# Altium schematic sheet VGA.SchDoc (part 2 of 3)
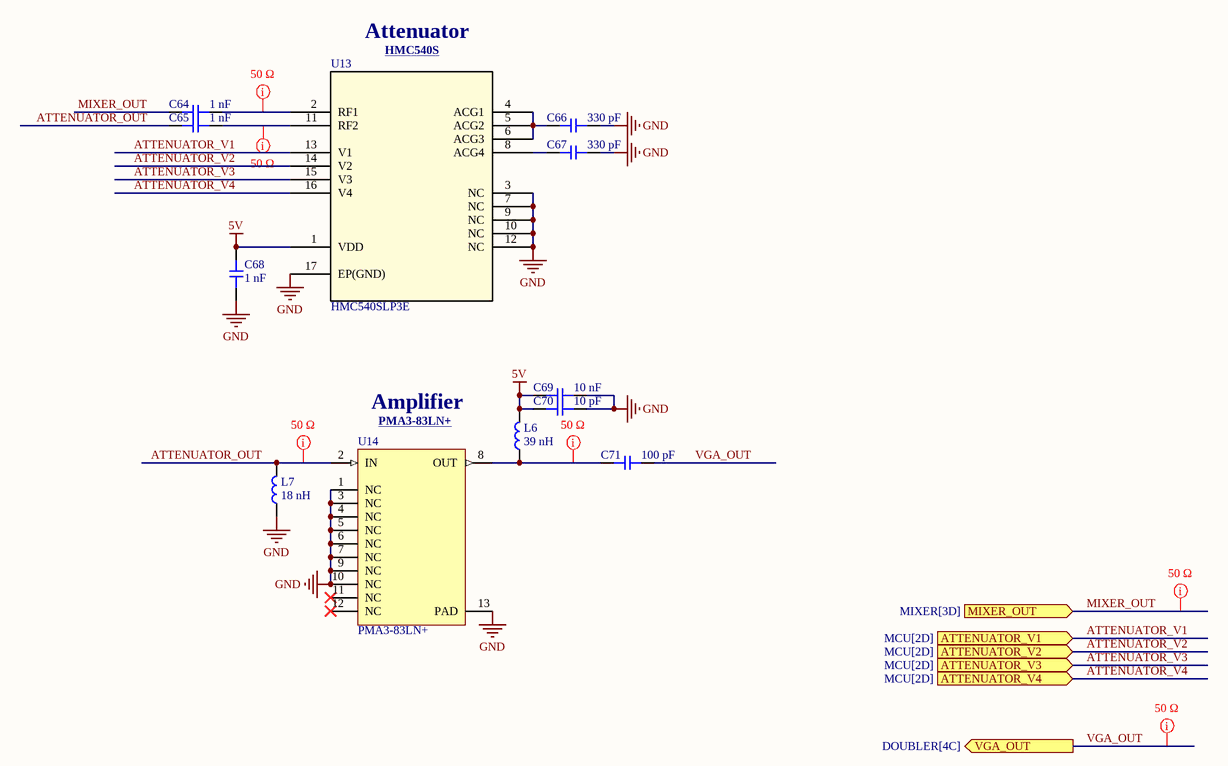
[diagram p1: VGA.SchDoc]
## Library data of the parts
C64 C65 C68 = CAP: 50V 1nF X7R ±10% 0402 Multilayer Ceramic Capacitors MLCC - SMD/SMT ROHS; Manufacturer: Yageo; Manufacturer Part Number: CC0402KRX7R9BB102; Tolerance: +-10%; Insulation Resistance: 100GΩ; Temperature Coefficient: 30ppm/°C; Voltage Rating: 50 V; Dielectric: Ceramic; Package Size: 0402; Supplier: DigiKey; Supplier Part Number: 311-1036-1-ND; RoHS: Compliant; Category: Ceramic Capacitors; Stock: 3090255; Pricing: 1=0.08, 10=0.004 (USD); Value: 1nF; Case/Package: 0402; Case Code (Imperial): 0402; Case Code (Metric): 1005; China RoHS: Compliant; Composition: Ceramic; Country of Origin: Mainland China, Taiwan; Depth: 500µm; Dielectric Material: Ceramic; Export Control Classification Number (ECCN) Code: EAR99; Halogen Free: Halogen Free; Height: 500µm; Harmonized Tariff Schedule (HTS) Code: 8532.24.00.20; Introduction Date: 2003-01-27; Lead Free: Lead Free; Length: 1mm; Lifecycle Status: Production; Material: Ceramic; Max Operating Temperature: 125°C; Min Operating Temperature: -55°C; Mounting Technology: Surface Mount; Pins: 2; Number of Terminals: 2; Radiation Hardening: No; REACH SVHC: Yes; Schedule B: 8532240020, 8532240020|8532240020|8532240020|8532240020|8532240020|8532240020|8532240020|8532240020|8532240020|8532240020|8532240020|8532240020|8532240020|8532240020|8532240020|8532240020|8532240020|8532240020|8532240020|8532240020|8532240020|8532240020|8532240020|85; Termination: SMD/SMT; Thickness: 558.8µm; Voltage: 50V; Voltage Rating (AC): 50V; Voltage Rating (DC): 50V; Width: 500µm; ComponentLink1URL: https://datasheet.octopart.com:443/CC0402KRX7R9BB102-Yageo-datasheet-177165144.pdf?src-supplier=IHS; ComponentLink1Description: https://datasheet.octopart.com:443/CC0402KRX7R9BB102-Yageo-datasheet-177165144.pdf?src-supplier=IHS; ComponentLink2URL: https://datasheet.octopart.com:443/CC0402KRX7R9BB102-Yageo-datasheet-82288757.pdf?src-supplier=Upverter; ComponentLink2Description: https://datasheet.octopart.com:443/CC0402KRX7R9BB102-Yageo-datasheet-82288757.pdf?src-supplier=Upverter; ComponentLink3URL: https://datasheet.octopart.com:443/CC0402KRX7R9BB102-Yageo-datasheet-78855684.pdf?src-supplier=Upverter; ComponentLink3Description: https://datasheet.octopart.com:443/CC0402KRX7R9BB102-Yageo-datasheet-78855684.pdf?src-supplier=Upverter; ComponentLink4URL: https://datasheet.octopart.com/CC0402KRX7R9BB102-Yageo-datasheet-10883670.pdf; ComponentLink4Description: https://datasheet.octopart.com/CC0402KRX7R9BB102-Yageo-datasheet-10883670.pdf; ComponentLink5URL: https://datasheet.octopart.com:443/CC0402KRX7R9BB102-Yageo-datasheet-147453679.pdf?src-supplier=Farnell; ComponentLink5Description: https://datasheet.octopart.com:443/CC0402KRX7R9BB102-Yageo-datasheet-147453679.pdf?src-supplier=Farnell; ComponentLink6URL: https://datasheet.octopart.com:443/CC0402KRX7R9BB102-Yageo-datasheet-151948686.pdf?src-supplier=Farnell; ComponentLink6Description: https://datasheet.octopart.com:443/CC0402KRX7R9BB102-Yageo-datasheet-151948686.pdf?src-supplier=Farnell; ComponentLink7URL: https://datasheet.octopart.com:443/CC0402KRX7R9BB102-Phycomp-datasheet-500777.pdf?src-supplier=Farnell; ComponentLink7Description: https://datasheet.octopart.com:443/CC0402KRX7R9BB102-Phycomp-datasheet-500777.pdf?src-supplier=Farnell; ComponentLink8URL: https://datasheet.octopart.com:443/CC0402KRX7R9BB102-Yageo-datasheet-5301394.pdf?src-supplier=Newark; ComponentLink8Description: https://datasheet.octopart.com:443/CC0402KRX7R9BB102-Yageo-datasheet-5301394.pdf?src-supplier=Newark; ComponentLink9URL: https://datasheet.octopart.com:443/CC0402KRX7R9BB102-Yageo-datasheet-62336348.pdf?src-supplier=Newark; ComponentLink9Description: https://datasheet.octopart.com:443/CC0402KRX7R9BB102-Yageo-datasheet-62336348.pdf?src-supplier=Newark; ComponentLink10URL: https://datasheet.octopart.com:443/CC0402KRX7R9BB102-Yageo-datasheet-182878162.pdf?src-supplier=Newark; ComponentLink10Description: https://datasheet.octopart.com:443/CC0402KRX7R9BB102-Yageo-datasheet-182878162.pdf?src-supplier=Newark; ComponentLink11URL: https://datasheet.octopart.com:443/CC0402KRX7R9BB102-Phycomp-datasheet-499490.pdf?src-supplier=element14; ComponentLink11Description: https://datasheet.octopart.com:443/CC0402KRX7R9BB102-Phycomp-datasheet-499490.pdf?src-supplier=element14; ComponentLink12URL: https://datasheet.octopart.com:443/CC0402KRX7R9BB102-Yageo-datasheet-8701427.pdf?src-supplier=element14; ComponentLink12Description: https://datasheet.octopart.com:443/CC0402KRX7R9BB102-Yageo-datasheet-8701427.pdf?src-supplier=element14; ComponentLink13URL: https://datasheet.octopart.com:443/CC0402KRX7R9BB102-Yageo-datasheet-166511530.pdf?src-supplier=Future+Electronics; ComponentLink13Description: https://datasheet.octopart.com:443/CC0402KRX7R9BB102-Yageo-datasheet-166511530.pdf?src-supplier=Future+Electronics; ComponentLink14URL: https://datasheet.octopart.com:443/CC0402KRX7R9BB102-Yageo-datasheet-137700082.pdf?src-supplier=Future+Electronics; ComponentLink14Description: https://datasheet.octopart.com:443/CC0402KRX7R9BB102-Yageo-datasheet-137700082.pdf?src-supplier=Future+Electronics; ComponentLink15URL: https://datasheet.octopart.com:443/CC0402KRX7R9BB102-Yageo-datasheet-137700084.pdf?src-supplier=Future+Electronics; ComponentLink15Description: https://datasheet.octopart.com:443/CC0402KRX7R9BB102-Yageo-datasheet-137700084.pdf?src-supplier=Future+Electronics; ComponentLink16URL: https://datasheet.octopart.com:443/CC0402KRX7R9BB102-Yageo-datasheet-78855685.pdf?src-supplier=Future+Electronics; ComponentLink16Description: https://datasheet.octopart.com:443/CC0402KRX7R9BB102-Yageo-datasheet-78855685.pdf?src-supplier=Future+Electronics; ComponentLink17URL: https://datasheet.octopart.com:443/CC0402KRX7R9BB102-Yageo-datasheet-27626582.pdf?src-supplier=Future+Electronics; ComponentLink17Description: https://datasheet.octopart.com:443/CC0402KRX7R9BB102-Yageo-datasheet-27626582.pdf?src-supplier=Future+Electronics; ComponentLink18URL: https://datasheet.octopart.com:443/CC0402KRX7R9BB102-Yageo-datasheet-24578986.pdf?src-supplier=Future+Electronics; ComponentLink18Description: https://datasheet.octopart.com:443/CC0402KRX7R9BB102-Yageo-datasheet-24578986.pdf?src-supplier=Future+Electronics; ComponentLink19URL: https://datasheet.octopart.com:443/CC0402KRX7R9BB102-Yageo-datasheet-15895757.pdf?src-supplier=Future+Electronics; ComponentLink19Description: https://datasheet.octopart.com:443/CC0402KRX7R9BB102-Yageo-datasheet-15895757.pdf?src-supplier=Future+Electronics; ComponentLink20URL: https://datasheet.octopart.com:443/CC0402KRX7R9BB102-Yageo-datasheet-12526321.pdf?src-supplier=Future+Electronics; ComponentLink20Description: https://datasheet.octopart.com:443/CC0402KRX7R9BB102-Yageo-datasheet-12526321.pdf?src-supplier=Future+Electronics; ComponentLink21URL: https://datasheet.octopart.com:443/CC0402KRX7R9BB102-Yageo-datasheet-8324192.pdf?src-supplier=Future+Electronics; ComponentLink21Description: https://datasheet.octopart.com:443/CC0402KRX7R9BB102-Yageo-datasheet-8324192.pdf?src-supplier=Future+Electronics; ComponentLink22URL: https://datasheet.octopart.com:443/CC0402KRX7R9BB102-Yageo-datasheet-68298032.pdf?src-supplier=Future+Electronics; ComponentLink22Description: https://datasheet.octopart.com:443/CC0402KRX7R9BB102-Yageo-datasheet-68298032.pdf?src-supplier=Future+Electronics; ComponentLink23URL: https://datasheet.octopart.com:443/CC0402KRX7R9BB102-Yageo-datasheet-178018854.pdf?src-supplier=Burklin+Elektronik; ComponentLink23Description: https://datasheet.octopart.com:443/CC0402KRX7R9BB102-Yageo-datasheet-178018854.pdf?src-supplier=Burklin+Elektronik; ComponentLink24URL: https://datasheet.octopart.com:443/CC0402KRX7R9BB102-Yageo-Group-datasheet-165992755.pdf?src-supplier=ODG+(Origin+Data+Global); ComponentLink24Description: https://datasheet.octopart.com:443/CC0402KRX7R9BB102-Yageo-Group-datasheet-165992755.pdf?src-supplier=ODG+(Origin+Data+Global); ComponentLink25URL: https://datasheet.octopart.com:443/CC0402KRX7R9BB102-Yageo-datasheet-120101875.pdf?src-supplier=Megastar; ComponentLink25Description: https://datasheet.octopart.com:443/CC0402KRX7R9BB102-Yageo-datasheet-120101875.pdf?src-supplier=Megastar; ComponentLink26URL: https://datasheet.octopart.com:443/CC0402KRX7R9BB102-Yageo-datasheet-118396.pdf?src-supplier=DigiKey; ComponentLink26Description: https://datasheet.octopart.com:443/CC0402KRX7R9BB102-Yageo-datasheet-118396.pdf?src-supplier=DigiKey; ComponentLink27URL: http://sigma.octopart.com:80/conflict_mineral_statement/Yageo-company-3.pdf?src-supplier=Compliance+Statements; ComponentLink27Description: http://sigma.octopart.com:80/conflict_mineral_statement/Yageo-company-3.pdf?src-supplier=Compliance+Statements; ComponentLink28URL: http://sigma.octopart.com:80/rohs_statement/Yageo-company-2.pdf?src-supplier=Compliance+Statements; ComponentLink28Description: http://sigma.octopart.com:80/rohs_statement/Yageo-company-2.pdf?src-supplier=Compliance+Statements
C66 C67 = CAP: 50V 330pF C0G ±5% 0402 Multilayer Ceramic Capacitors MLCC - SMD/SMT ROHS; Manufacturer: Murata Electronics; Manufacturer Part Number: GRM1555C1H331JA01D; Manufacturer Lifecycle Status: IN PRODUCTION; Tolerance: +-5%; Insulation Resistance: 10GΩ; Temperature Coefficient: 30ppm/°C; Voltage Rating: 50 V; Dielectric: Ceramic; Package Size: 0402; Supplier: DigiKey; Supplier Part Number: 490-1295-1-ND; RoHS: Compliant; Category: Ceramic Capacitors; Stock: 677891; Pricing: 1=0.1, 10=0.045, 50=0.031, 100=0.0266, 500=0.01924, 1000=0.01699, 2500=0.01463, 5000=0.01321 (USD); Value: 330pF; Case/Package: 0402; Case Code (Imperial): 0402; Case Code (Metric): 1005; Depth: 500µm; Dielectric Material: Ceramic; Height: 500µm; Lead Free: Lead Free; Length: 1mm; Lifecycle Status: Production; Material: Ceramic; Max Operating Temperature: 125°C; Min Operating Temperature: -55°C; Mounting Technology: Surface Mount; Pins: 2; Number of Terminals: 2; Packaging: Cut Tape; Radiation Hardening: No; REACH SVHC: Yes; Schedule B: 8532240020, 8532240020|8532240020, 8532240020|8532240020|8532240020, 8532240020|8532240020|8532240020|8532240020; Termination: SMD/SMT; Thickness: 500µm; Voltage: 50V; Voltage Rating (DC): 50V; Width: 500µm; ComponentLink1URL: https://datasheet.octopart.com:443/GRM1555C1H331JA01D-Murata-datasheet-501912.pdf?src-supplier=element14+APAC; ComponentLink1Description: https://datasheet.octopart.com:443/GRM1555C1H331JA01D-Murata-datasheet-501912.pdf?src-supplier=element14+APAC; ComponentLink2URL: https://datasheet.octopart.com:443/GRM1555C1H331JA01D-Murata-datasheet-62320222.pdf?src-supplier=Farnell; ComponentLink2Description: https://datasheet.octopart.com:443/GRM1555C1H331JA01D-Murata-datasheet-62320222.pdf?src-supplier=Farnell; ComponentLink3URL: https://datasheet.octopart.com:443/GRM1555C1H331JA01D-Murata-datasheet-514334.pdf?src-supplier=Farnell; ComponentLink3Description: https://datasheet.octopart.com:443/GRM1555C1H331JA01D-Murata-datasheet-514334.pdf?src-supplier=Farnell; ComponentLink4URL: https://datasheet.octopart.com:443/GRM1555C1H331JA01D-Murata-datasheet-165579666.pdf?src-supplier=TME; ComponentLink4Description: https://datasheet.octopart.com:443/GRM1555C1H331JA01D-Murata-datasheet-165579666.pdf?src-supplier=TME; ComponentLink5URL: https://datasheet.octopart.com:443/GRM1555C1H331JA01D-Murata-datasheet-59876780.pdf?src-supplier=TME; ComponentLink5Description: https://datasheet.octopart.com:443/GRM1555C1H331JA01D-Murata-datasheet-59876780.pdf?src-supplier=TME; ComponentLink6URL: https://datasheet.octopart.com:443/GRM1555C1H331JA01D-Murata-datasheet-141266224.pdf?src-supplier=Ciiva; ComponentLink6Description: https://datasheet.octopart.com:443/GRM1555C1H331JA01D-Murata-datasheet-141266224.pdf?src-supplier=Ciiva; ComponentLink7URL: https://datasheet.octopart.com:443/GRM1555C1H331JA01D-Murata-datasheet-140681877.pdf?src-supplier=Ciiva; ComponentLink7Description: https://datasheet.octopart.com:443/GRM1555C1H331JA01D-Murata-datasheet-140681877.pdf?src-supplier=Ciiva; ComponentLink8URL: https://datasheet.octopart.com:443/GRM1555C1H331JA01D-Murata-datasheet-138739571.pdf?src-supplier=Ciiva; ComponentLink8Description: https://datasheet.octopart.com:443/GRM1555C1H331JA01D-Murata-datasheet-138739571.pdf?src-supplier=Ciiva; ComponentLink9URL: https://datasheet.octopart.com:443/GRM1555C1H331JA01D-Murata-datasheet-22122223.pdf?src-supplier=Future+Electronics; ComponentLink9Description: https://datasheet.octopart.com:443/GRM1555C1H331JA01D-Murata-datasheet-22122223.pdf?src-supplier=Future+Electronics; ComponentLink10URL: https://datasheet.octopart.com:443/GRM1555C1H331JA01D-Murata-datasheet-44781494.pdf?src-supplier=Future+Electronics; ComponentLink10Description: https://datasheet.octopart.com:443/GRM1555C1H331JA01D-Murata-datasheet-44781494.pdf?src-supplier=Future+Electronics; ComponentLink11URL: https://datasheet.octopart.com/GRM1555C1H331JA01D-Murata-datasheet-12515295.pdf; ComponentLink11Description: https://datasheet.octopart.com/GRM1555C1H331JA01D-Murata-datasheet-12515295.pdf; ComponentLink12URL: https://datasheet.octopart.com/GRM1555C1H331JA01D-Murata-datasheet-12510076.pdf; ComponentLink12Description: https://datasheet.octopart.com/GRM1555C1H331JA01D-Murata-datasheet-12510076.pdf; ComponentLink13URL: https://datasheet.octopart.com/GRM1555C1H331JA01D-Murata-datasheet-11978611.pdf; ComponentLink13Description: https://datasheet.octopart.com/GRM1555C1H331JA01D-Murata-datasheet-11978611.pdf; ComponentLink14URL: https://datasheet.octopart.com/GRM1555C1H331JA01D-Murata-datasheet-10025737.pdf; ComponentLink14Description: https://datasheet.octopart.com/GRM1555C1H331JA01D-Murata-datasheet-10025737.pdf; ComponentLink15URL: https://datasheet.octopart.com/GRM1555C1H331JA01D-Murata-datasheet-8819587.pdf; ComponentLink15Description: https://datasheet.octopart.com/GRM1555C1H331JA01D-Murata-datasheet-8819587.pdf; ComponentLink16URL: https://datasheet.octopart.com/GRM1555C1H331JA01D-Murata-datasheet-14396429.pdf; ComponentLink16Description: https://datasheet.octopart.com/GRM1555C1H331JA01D-Murata-datasheet-14396429.pdf; ComponentLink17URL: https://datasheet.octopart.com:443/GRM1555C1H331JA01D-Murata-datasheet-11806122.pdf?src-supplier=Arrow+Electronics; ComponentLink17Description: https://datasheet.octopart.com:443/GRM1555C1H331JA01D-Murata-datasheet-11806122.pdf?src-supplier=Arrow+Electronics; ComponentLink18URL: https://datasheet.octopart.com:443/GRM1555C1H331JA01D-Murata-datasheet-8217091.pdf?src-supplier=Jameco+(USA); ComponentLink18Description: https://datasheet.octopart.com:443/GRM1555C1H331JA01D-Murata-datasheet-8217091.pdf?src-supplier=Jameco+(USA); ComponentLink19URL: https://datasheet.octopart.com:443/GRM1555C1H331JA01D-Murata-datasheet-148211.pdf?src-supplier=Garrett; ComponentLink19Description: https://datasheet.octopart.com:443/GRM1555C1H331JA01D-Murata-datasheet-148211.pdf?src-supplier=Garrett; ComponentLink20URL: https://datasheet.octopart.com:443/GRM1555C1H331JA01D-Murata-datasheet-102.pdf?src-supplier=DigiKey; ComponentLink20Description: https://datasheet.octopart.com:443/GRM1555C1H331JA01D-Murata-datasheet-102.pdf?src-supplier=DigiKey; ComponentLink21URL: http://sigma.octopart.com:80/reach_statement/Murata-company-16.pdf?src-supplier=Compliance+Statements; ComponentLink21Description: http://sigma.octopart.com:80/reach_statement/Murata-company-16.pdf?src-supplier=Compliance+Statements
C69 = CAP: Multilayer Ceramic Capacitor, 0.01 uF, 25 V, ± 10%, X7R, 0402 [1005 Metric]; Manufacturer: Murata Electronics; Manufacturer Part Number: GRM155R71E103KA01D; Manufacturer Lifecycle Status: NRND; Tolerance: +-10%; Voltage Rating: 25 V; Value: 10nF; Insulation Resistance: 10GΩ; Voltage: 25V; Dielectric: Ceramic; Package Size: 0402; Supplier: DigiKey; Supplier Part Number: 490-1312-1-ND; RoHS: Compliant; Category: Ceramic Capacitors; Stock: 4766377; Pricing: 1=0.1, 10=0.021, 50=0.014, 100=0.0118, 500=0.00822, 1000=0.00713, 2500=0.00598, 5000=0.00529 (USD); Case/Package: 0402; Case Code (Imperial): 0402; Case Code (Metric): 1005; Country of Origin: Japan, Mainland China, Philippines, Singapore, Thailand; Depth: 500µm; Dielectric Material: Ceramic; Export Control Classification Number (ECCN) Code: EAR99; Height: 500µm; Harmonized Tariff Schedule (HTS) Code: 8532.24.00.20; Introduction Date: 2004-11-19; Lead Free: Lead Free; Length: 1mm; Lifecycle Status: NRND; Material: Ceramic; Max Operating Temperature: 125°C; Min Operating Temperature: -55°C; Mounting Technology: Surface Mount; Pins: 2; Number of Terminals: 2; Radiation Hardening: No; REACH SVHC: Yes; Schedule B: 8532240020, 8532240020|8532240020, 8532240020|8532240020|8532240020, 8532240020|8532240020|8532240020|8532240020; Termination: SMD/SMT; Thickness: 500µm; Voltage Rating (DC): 25V; Width: 500µm; ComponentLink1URL: https://datasheet.octopart.com:443/GRM155R71E103KA01D-Murata-datasheet-501912.pdf?src-supplier=Upverter; ComponentLink1Description: https://datasheet.octopart.com:443/GRM155R71E103KA01D-Murata-datasheet-501912.pdf?src-supplier=Upverter; ComponentLink2URL: https://datasheet.octopart.com:443/GRM155R71E103KA01D-Murata-datasheet-8326352.pdf?src-supplier=element14+APAC; ComponentLink2Description: https://datasheet.octopart.com:443/GRM155R71E103KA01D-Murata-datasheet-8326352.pdf?src-supplier=element14+APAC; ComponentLink3URL: https://datasheet.octopart.com:443/GRM155R71E103KA01D-Murata-datasheet-62320227.pdf?src-supplier=element14+APAC; ComponentLink3Description: https://datasheet.octopart.com:443/GRM155R71E103KA01D-Murata-datasheet-62320227.pdf?src-supplier=element14+APAC; ComponentLink4URL: https://datasheet.octopart.com:443/GRM155R71E103KA01D-Murata-datasheet-12548432.pdf?src-supplier=_legacy+Avnet; ComponentLink4Description: https://datasheet.octopart.com:443/GRM155R71E103KA01D-Murata-datasheet-12548432.pdf?src-supplier=_legacy+Avnet; ComponentLink5URL: https://datasheet.octopart.com:443/GRM155R71E103KA01D-Murata-datasheet-14396901.pdf?src-supplier=Future+Electronics; ComponentLink5Description: https://datasheet.octopart.com:443/GRM155R71E103KA01D-Murata-datasheet-14396901.pdf?src-supplier=Future+Electronics; ComponentLink6URL: https://datasheet.octopart.com:443/GRM155R71E103KA01D-Murata-datasheet-22122223.pdf?src-supplier=Future+Electronics; ComponentLink6Description: https://datasheet.octopart.com:443/GRM155R71E103KA01D-Murata-datasheet-22122223.pdf?src-supplier=Future+Electronics; ComponentLink7URL: https://datasheet.octopart.com:443/GRM155R71E103KA01D-Murata-datasheet-44106405.pdf?src-supplier=Future+Electronics; ComponentLink7Description: https://datasheet.octopart.com:443/GRM155R71E103KA01D-Murata-datasheet-44106405.pdf?src-supplier=Future+Electronics; ComponentLink8URL: https://datasheet.octopart.com:443/GRM155R71E103KA01D-Murata-datasheet-165579666.pdf?src-supplier=TME; ComponentLink8Description: https://datasheet.octopart.com:443/GRM155R71E103KA01D-Murata-datasheet-165579666.pdf?src-supplier=TME; ComponentLink9URL: https://datasheet.octopart.com:443/GRM155R71E103KA01D-Murata-datasheet-59876780.pdf?src-supplier=TME; ComponentLink9Description: https://datasheet.octopart.com:443/GRM155R71E103KA01D-Murata-datasheet-59876780.pdf?src-supplier=TME; ComponentLink10URL: https://datasheet.octopart.com:443/GRM155R71E103KA01D-Murata-datasheet-141266224.pdf?src-supplier=Ciiva; ComponentLink10Description: https://datasheet.octopart.com:443/GRM155R71E103KA01D-Murata-datasheet-141266224.pdf?src-supplier=Ciiva; ComponentLink11URL: https://datasheet.octopart.com:443/GRM155R71E103KA01D-Murata-datasheet-140691364.pdf?src-supplier=Ciiva; ComponentLink11Description: https://datasheet.octopart.com:443/GRM155R71E103KA01D-Murata-datasheet-140691364.pdf?src-supplier=Ciiva; ComponentLink12URL: https://datasheet.octopart.com:443/GRM155R71E103KA01D-Murata-datasheet-138740934.pdf?src-supplier=Ciiva; ComponentLink12Description: https://datasheet.octopart.com:443/GRM155R71E103KA01D-Murata-datasheet-138740934.pdf?src-supplier=Ciiva; ComponentLink13URL: https://datasheet.octopart.com:443/GRM155R71E103KA01D-Murata-datasheet-120101189.pdf?src-supplier=Megastar; ComponentLink13Description: https://datasheet.octopart.com:443/GRM155R71E103KA01D-Murata-datasheet-120101189.pdf?src-supplier=Megastar; ComponentLink14URL: https://datasheet.octopart.com/GRM155R71E103KA01D-Murata-datasheet-12515295.pdf; ComponentLink14Description: https://datasheet.octopart.com/GRM155R71E103KA01D-Murata-datasheet-12515295.pdf; ComponentLink15URL: https://datasheet.octopart.com/GRM155R71E103KA01D-Murata-datasheet-12510076.pdf; ComponentLink15Description: https://datasheet.octopart.com/GRM155R71E103KA01D-Murata-datasheet-12510076.pdf; ComponentLink16URL: https://datasheet.octopart.com/GRM155R71E103KA01D-Murata-datasheet-11978611.pdf; ComponentLink16Description: https://datasheet.octopart.com/GRM155R71E103KA01D-Murata-datasheet-11978611.pdf; ComponentLink17URL: https://datasheet.octopart.com/GRM155R71E103KA01D-Murata-datasheet-10025737.pdf; ComponentLink17Description: https://datasheet.octopart.com/GRM155R71E103KA01D-Murata-datasheet-10025737.pdf; ComponentLink18URL: https://datasheet.octopart.com/GRM155R71E103KA01D-Murata-datasheet-8819587.pdf; ComponentLink18Description: https://datasheet.octopart.com/GRM155R71E103KA01D-Murata-datasheet-8819587.pdf; ComponentLink19URL: https://datasheet.octopart.com:443/GRM155R71E103KA01D-Murata-datasheet-632409.pdf?src-supplier=Farnell; ComponentLink19Description: https://datasheet.octopart.com:443/GRM155R71E103KA01D-Murata-datasheet-632409.pdf?src-supplier=Farnell; ComponentLink20URL: https://datasheet.octopart.com:443/GRM155R71E103KA01D-Murata-datasheet-514334.pdf?src-supplier=Farnell; ComponentLink20Description: https://datasheet.octopart.com:443/GRM155R71E103KA01D-Murata-datasheet-514334.pdf?src-supplier=Farnell; ComponentLink21URL: https://datasheet.octopart.com:443/GRM155R71E103KA01D-Murata-datasheet-148211.pdf?src-supplier=Garrett; ComponentLink21Description: https://datasheet.octopart.com:443/GRM155R71E103KA01D-Murata-datasheet-148211.pdf?src-supplier=Garrett; ComponentLink22URL: https://datasheet.octopart.com:443/GRM155R71E103KA01D-Murata-datasheet-102.pdf?src-supplier=DigiKey; ComponentLink22Description: https://datasheet.octopart.com:443/GRM155R71E103KA01D-Murata-datasheet-102.pdf?src-supplier=DigiKey; ComponentLink23URL: http://sigma.octopart.com:80/reach_statement/Murata-company-16.pdf?src-supplier=Compliance+Statements; ComponentLink23Description: http://sigma.octopart.com:80/reach_statement/Murata-company-16.pdf?src-supplier=Compliance+Statements
C70 = CAP: 50V 10pF C0G ±1% 0402 Multilayer Ceramic Capacitors MLCC - SMD/SMT ROHS; Manufacturer: Murata Electronics; Manufacturer Part Number: GRM1555C1H100FA01D; Manufacturer Lifecycle Status: NRND; Tolerance: +-1%; Voltage Rating: 50 V; Dielectric: Ceramic; Package Size: 0402; Supplier: DigiKey; Supplier Part Number: 490-6186-1-ND; RoHS: Compliant; Category: Ceramic Capacitors; Stock: 3575844; Pricing: 1=0.1, 10=0.042, 50=0.0286, 100=0.0246, 500=0.0178, 1000=0.01571, 2500=0.01351, 5000=0.01219 (USD); Value: 10pF; Case/Package: 0402; Case Code (Imperial): 0402; Case Code (Metric): 1005; Depth: 500µm; Dielectric Material: Ceramic; Export Control Classification Number (ECCN) Code: EAR99; Height: 500µm; Harmonized Tariff Schedule (HTS) Code: 8532.24.00.20; Introduction Date: 2012-06-13; Lead Free: Lead Free; Length: 1mm; Lifecycle Status: NRND; Max Operating Temperature: 125°C; Min Operating Temperature: -55°C; Mounting Technology: Surface Mount; Number of Terminals: 2; Packaging: Cut Tape; Radiation Hardening: No; REACH SVHC: Yes; Schedule B: 8532240020, 8532240020|8532240020, 8532240020|8532240020|8532240020, 8532240020|8532240020|8532240020|8532240020; Termination: SMD/SMT; Thickness: 500µm; Voltage Rating (DC): 50V; Width: 500µm; ComponentLink1URL: https://datasheet.octopart.com:443/GRM1555C1H100FA01D-Murata-datasheet-66077043.pdf?src-supplier=element14+APAC; ComponentLink1Description: https://datasheet.octopart.com:443/GRM1555C1H100FA01D-Murata-datasheet-66077043.pdf?src-supplier=element14+APAC; ComponentLink2URL: https://datasheet.octopart.com:443/GRM1555C1H100FA01D-Murata-datasheet-141266224.pdf?src-supplier=Ciiva; ComponentLink2Description: https://datasheet.octopart.com:443/GRM1555C1H100FA01D-Murata-datasheet-141266224.pdf?src-supplier=Ciiva; ComponentLink3URL: https://datasheet.octopart.com:443/GRM1555C1H100FA01D-Murata-datasheet-140680630.pdf?src-supplier=Ciiva; ComponentLink3Description: https://datasheet.octopart.com:443/GRM1555C1H100FA01D-Murata-datasheet-140680630.pdf?src-supplier=Ciiva; ComponentLink4URL: https://datasheet.octopart.com:443/GRM1555C1H100FA01D-Murata-datasheet-138739437.pdf?src-supplier=Ciiva; ComponentLink4Description: https://datasheet.octopart.com:443/GRM1555C1H100FA01D-Murata-datasheet-138739437.pdf?src-supplier=Ciiva; ComponentLink5URL: https://datasheet.octopart.com:443/GRM1555C1H100FA01D-Murata-datasheet-120101189.pdf?src-supplier=Megastar; ComponentLink5Description: https://datasheet.octopart.com:443/GRM1555C1H100FA01D-Murata-datasheet-120101189.pdf?src-supplier=Megastar; ComponentLink6URL: https://datasheet.octopart.com:443/GRM1555C1H100FA01D-Murata-datasheet-22122223.pdf?src-supplier=Future+Electronics; ComponentLink6Description: https://datasheet.octopart.com:443/GRM1555C1H100FA01D-Murata-datasheet-22122223.pdf?src-supplier=Future+Electronics; ComponentLink7URL: https://datasheet.octopart.com:443/GRM1555C1H100FA01D-Murata-datasheet-12510170.pdf?src-supplier=Future+Electronics; ComponentLink7Description: https://datasheet.octopart.com:443/GRM1555C1H100FA01D-Murata-datasheet-12510170.pdf?src-supplier=Future+Electronics; ComponentLink8URL: https://datasheet.octopart.com:443/GRM1555C1H100FA01D-Murata-datasheet-8517407.pdf?src-supplier=Future+Electronics; ComponentLink8Description: https://datasheet.octopart.com:443/GRM1555C1H100FA01D-Murata-datasheet-8517407.pdf?src-supplier=Future+Electronics; ComponentLink9URL: https://datasheet.octopart.com:443/GRM1555C1H100FA01D-Murata-datasheet-8387045.pdf?src-supplier=Future+Electronics; ComponentLink9Description: https://datasheet.octopart.com:443/GRM1555C1H100FA01D-Murata-datasheet-8387045.pdf?src-supplier=Future+Electronics; ComponentLink10URL: https://datasheet.octopart.com:443/GRM1555C1H100FA01D-Murata-datasheet-8324201.pdf?src-supplier=Future+Electronics; ComponentLink10Description: https://datasheet.octopart.com:443/GRM1555C1H100FA01D-Murata-datasheet-8324201.pdf?src-supplier=Future+Electronics; ComponentLink11URL: https://datasheet.octopart.com:443/GRM1555C1H100FA01D-Murata-datasheet-7628724.pdf?src-supplier=Future+Electronics; ComponentLink11Description: https://datasheet.octopart.com:443/GRM1555C1H100FA01D-Murata-datasheet-7628724.pdf?src-supplier=Future+Electronics; ComponentLink12URL: https://datasheet.octopart.com:443/GRM1555C1H100FA01D-Murata-datasheet-552801.pdf?src-supplier=Future+Electronics; ComponentLink12Description: https://datasheet.octopart.com:443/GRM1555C1H100FA01D-Murata-datasheet-552801.pdf?src-supplier=Future+Electronics; ComponentLink13URL: https://datasheet.octopart.com/GRM1555C1H100FA01D-Murata-datasheet-12515295.pdf; ComponentLink13Description: https://datasheet.octopart.com/GRM1555C1H100FA01D-Murata-datasheet-12515295.pdf; ComponentLink14URL: https://datasheet.octopart.com/GRM1555C1H100FA01D-Murata-datasheet-12510076.pdf; ComponentLink14Description: https://datasheet.octopart.com/GRM1555C1H100FA01D-Murata-datasheet-12510076.pdf; ComponentLink15URL: https://datasheet.octopart.com/GRM1555C1H100FA01D-Murata-datasheet-11978611.pdf; ComponentLink15Description: https://datasheet.octopart.com/GRM1555C1H100FA01D-Murata-datasheet-11978611.pdf; ComponentLink16URL: https://datasheet.octopart.com/GRM1555C1H100FA01D-Murata-datasheet-10025737.pdf; ComponentLink16Description: https://datasheet.octopart.com/GRM1555C1H100FA01D-Murata-datasheet-10025737.pdf; ComponentLink17URL: https://datasheet.octopart.com/GRM1555C1H100FA01D-Murata-datasheet-8819587.pdf; ComponentLink17Description: https://datasheet.octopart.com/GRM1555C1H100FA01D-Murata-datasheet-8819587.pdf; ComponentLink18URL: https://datasheet.octopart.com:443/GRM1555C1H100FA01D-Murata-datasheet-11729174.pdf?src-supplier=Arrow+Electronics; ComponentLink18Description: https://datasheet.octopart.com:443/GRM1555C1H100FA01D-Murata-datasheet-11729174.pdf?src-supplier=Arrow+Electronics; ComponentLink19URL: http://sigma.octopart.com:80/reach_statement/Murata-company-16.pdf?src-supplier=Compliance+Statements; ComponentLink19Description: http://sigma.octopart.com:80/reach_statement/Murata-company-16.pdf?src-supplier=Compliance+Statements
C71 = CAP: 50V 100pF NP0 ±5% 0402 Multilayer Ceramic Capacitors MLCC - SMD/SMT ROHS; Manufacturer: Yageo; Manufacturer Part Number: CC0402JRNPO9BN101; Tolerance: +-5%; Insulation Resistance: 100GΩ; Temperature Coefficient: 30ppm/°C; Voltage Rating: 50 V; Dielectric: Ceramic; Package Size: 0402; Supplier: DigiKey; Supplier Part Number: 311-1024-1-ND; RoHS: Compliant; Category: Ceramic Capacitors; Stock: 3080901; Pricing: 1=0.08, 10=0.003, 10000=0.0032, 20000=0.0031, 30000=0.00304, 50000=0.00283, 70000=0.00282 (USD); Value: 100pF; Case/Package: 0402; Case Code (Imperial): 0402; Case Code (Metric): 1005; China RoHS: Compliant; Composition: Ceramic; Depth: 500µm; Dielectric Material: Ceramic; Halogen Free: Halogen Free; Height: 500µm; Lead Free: Lead Free; Length: 1mm; Lifecycle Status: Production; Max Operating Temperature: 125°C; Min Operating Temperature: -55°C; Mounting Technology: Surface Mount; Pins: 2; Number of Terminals: 2; Radiation Hardening: No; REACH SVHC: Yes; Schedule B: 8532240020, 8532240020|8532240020|8532240020|8532240020|8532240020|8532240020|8532240020|8532240020|8532240020|8532240020|8532240020|8532240020|8532240020|8532240020|8532240020|8532240020|8532240020|8532240020|8532240020|8532240020|8532240020|8532240020|8532240020|85; Termination: SMD/SMT; Thickness: 558.8µm; Voltage: 50V; Voltage Rating (AC): 50V; Voltage Rating (DC): 50V; Width: 500µm; ComponentLink1URL: https://datasheet.octopart.com:443/CC0402JRNPO9BN101-Yageo-datasheet-182140217.pdf?src-supplier=IHS; ComponentLink1Description: https://datasheet.octopart.com:443/CC0402JRNPO9BN101-Yageo-datasheet-182140217.pdf?src-supplier=IHS; ComponentLink2URL: https://datasheet.octopart.com:443/CC0402JRNPO9BN101-Yageo-datasheet-10406438.pdf?src-supplier=element14+APAC; ComponentLink2Description: https://datasheet.octopart.com:443/CC0402JRNPO9BN101-Yageo-datasheet-10406438.pdf?src-supplier=element14+APAC; ComponentLink3URL: https://datasheet.octopart.com:443/CC0402JRNPO9BN101-Yageo-datasheet-151948684.pdf?src-supplier=element14+APAC; ComponentLink3Description: https://datasheet.octopart.com:443/CC0402JRNPO9BN101-Yageo-datasheet-151948684.pdf?src-supplier=element14+APAC; ComponentLink4URL: https://datasheet.octopart.com:443/CC0402JRNPO9BN101-Yageo-datasheet-67645495.pdf?src-supplier=element14+APAC; ComponentLink4Description: https://datasheet.octopart.com:443/CC0402JRNPO9BN101-Yageo-datasheet-67645495.pdf?src-supplier=element14+APAC; ComponentLink5URL: https://datasheet.octopart.com:443/CC0402JRNPO9BN101-Yageo-datasheet-10882999.pdf?src-supplier=element14+APAC; ComponentLink5Description: https://datasheet.octopart.com:443/CC0402JRNPO9BN101-Yageo-datasheet-10882999.pdf?src-supplier=element14+APAC; ComponentLink6URL: https://datasheet.octopart.com:443/CC0402JRNPO9BN101-Yageo-datasheet-78855684.pdf?src-supplier=Upverter; ComponentLink6Description: https://datasheet.octopart.com:443/CC0402JRNPO9BN101-Yageo-datasheet-78855684.pdf?src-supplier=Upverter; ComponentLink7URL: https://datasheet.octopart.com:443/CC0402JRNPO9BN101-Yageo-Group-datasheet-188689597.pdf?src-supplier=Farnell; ComponentLink7Description: https://datasheet.octopart.com:443/CC0402JRNPO9BN101-Yageo-Group-datasheet-188689597.pdf?src-supplier=Farnell; ComponentLink8URL: https://datasheet.octopart.com:443/CC0402JRNPO9BN101-Yageo-datasheet-10621397.pdf?src-supplier=Farnell; ComponentLink8Description: https://datasheet.octopart.com:443/CC0402JRNPO9BN101-Yageo-datasheet-10621397.pdf?src-supplier=Farnell; ComponentLink9URL: https://datasheet.octopart.com:443/CC0402JRNPO9BN101-Yageo-datasheet-65873193.pdf?src-supplier=Newark; ComponentLink9Description: https://datasheet.octopart.com:443/CC0402JRNPO9BN101-Yageo-datasheet-65873193.pdf?src-supplier=Newark; ComponentLink10URL: https://datasheet.octopart.com:443/CC0402JRNPO9BN101-Yageo-datasheet-5301394.pdf?src-supplier=Newark; ComponentLink10Description: https://datasheet.octopart.com:443/CC0402JRNPO9BN101-Yageo-datasheet-5301394.pdf?src-supplier=Newark; ComponentLink11URL: https://datasheet.octopart.com:443/CC0402JRNPO9BN101-Yageo-datasheet-182966517.pdf?src-supplier=Newark; ComponentLink11Description: https://datasheet.octopart.com:443/CC0402JRNPO9BN101-Yageo-datasheet-182966517.pdf?src-supplier=Newark; ComponentLink12URL: https://datasheet.octopart.com:443/CC0402JRNPO9BN101-Yageo-datasheet-137875056.pdf?src-supplier=Future+Electronics; ComponentLink12Description: https://datasheet.octopart.com:443/CC0402JRNPO9BN101-Yageo-datasheet-137875056.pdf?src-supplier=Future+Electronics; ComponentLink13URL: https://datasheet.octopart.com:443/CC0402JRNPO9BN101-Yageo-datasheet-136957424.pdf?src-supplier=Future+Electronics; ComponentLink13Description: https://datasheet.octopart.com:443/CC0402JRNPO9BN101-Yageo-datasheet-136957424.pdf?src-supplier=Future+Electronics; ComponentLink14URL: https://datasheet.octopart.com:443/CC0402JRNPO9BN101-Yageo-datasheet-137700082.pdf?src-supplier=Future+Electronics; ComponentLink14Description: https://datasheet.octopart.com:443/CC0402JRNPO9BN101-Yageo-datasheet-137700082.pdf?src-supplier=Future+Electronics; ComponentLink15URL: https://datasheet.octopart.com:443/CC0402JRNPO9BN101-Yageo-datasheet-62126864.pdf?src-supplier=Future+Electronics; ComponentLink15Description: https://datasheet.octopart.com:443/CC0402JRNPO9BN101-Yageo-datasheet-62126864.pdf?src-supplier=Future+Electronics; ComponentLink16URL: https://datasheet.octopart.com:443/CC0402JRNPO9BN101-Yageo-datasheet-62091628.pdf?src-supplier=Future+Electronics; ComponentLink16Description: https://datasheet.octopart.com:443/CC0402JRNPO9BN101-Yageo-datasheet-62091628.pdf?src-supplier=Future+Electronics; ComponentLink17URL: https://datasheet.octopart.com:443/CC0402JRNPO9BN101-Yageo-datasheet-24578986.pdf?src-supplier=Future+Electronics; ComponentLink17Description: https://datasheet.octopart.com:443/CC0402JRNPO9BN101-Yageo-datasheet-24578986.pdf?src-supplier=Future+Electronics; ComponentLink18URL: https://datasheet.octopart.com:443/CC0402JRNPO9BN101-Yageo-datasheet-16730043.pdf?src-supplier=Future+Electronics; ComponentLink18Description: https://datasheet.octopart.com:443/CC0402JRNPO9BN101-Yageo-datasheet-16730043.pdf?src-supplier=Future+Electronics; ComponentLink19URL: https://datasheet.octopart.com:443/CC0402JRNPO9BN101-Yageo-datasheet-12589826.pdf?src-supplier=Future+Electronics; ComponentLink19Description: https://datasheet.octopart.com:443/CC0402JRNPO9BN101-Yageo-datasheet-12589826.pdf?src-supplier=Future+Electronics; ComponentLink20URL: https://datasheet.octopart.com:443/CC0402JRNPO9BN101-Yageo-datasheet-8817079.pdf?src-supplier=element14; ComponentLink20Description: https://datasheet.octopart.com:443/CC0402JRNPO9BN101-Yageo-datasheet-8817079.pdf?src-supplier=element14; ComponentLink21URL: https://datasheet.octopart.com:443/CC0402JRNPO9BN101-Yageo-datasheet-8324240.pdf?src-supplier=element14; ComponentLink21Description: https://datasheet.octopart.com:443/CC0402JRNPO9BN101-Yageo-datasheet-8324240.pdf?src-supplier=element14; ComponentLink22URL: https://datasheet.octopart.com:443/CC0402JRNPO9BN101-Yageo-datasheet-504625.pdf?src-supplier=element14; ComponentLink22Description: https://datasheet.octopart.com:443/CC0402JRNPO9BN101-Yageo-datasheet-504625.pdf?src-supplier=element14; ComponentLink23URL: https://datasheet.octopart.com:443/CC0402JRNPO9BN101-Yageo-datasheet-5321569.pdf?src-supplier=element14; ComponentLink23Description: https://datasheet.octopart.com:443/CC0402JRNPO9BN101-Yageo-datasheet-5321569.pdf?src-supplier=element14; ComponentLink24URL: https://datasheet.octopart.com:443/CC0402JRNPO9BN101-Yageo-datasheet-68296204.pdf?src-supplier=Megastar; ComponentLink24Description: https://datasheet.octopart.com:443/CC0402JRNPO9BN101-Yageo-datasheet-68296204.pdf?src-supplier=Megastar; ComponentLink25URL: http://sigma.octopart.com:80/conflict_mineral_statement/Yageo-company-3.pdf?src-supplier=Compliance+Statements; ComponentLink25Description: http://sigma.octopart.com:80/conflict_mineral_statement/Yageo-company-3.pdf?src-supplier=Compliance+Statements; ComponentLink26URL: http://sigma.octopart.com:80/rohs_statement/Yageo-company-2.pdf?src-supplier=Compliance+Statements; ComponentLink26Description: http://sigma.octopart.com:80/rohs_statement/Yageo-company-2.pdf?src-supplier=Compliance+Statements
L6 = IND: Inductor RF Wirewound 0.039uH 5% 250MHz 25Q-Factor Ceramic 0.32A 0.55Ohm DCR 0402 T/R; Manufacturer: Bourns Inc.; Manufacturer Part Number: CW100505-39NJ; Tolerance: +-5%; Current Rating: 550 mA; DC Resistance (DCR): 550mΩ; Value: 39nH; Max Current Rating: 320mA; Number of Circuits: 1; Q Factor: 25; Self Resonant Frequency: 2.1GHz; Shielding: Unshielded; Core Material: Ceramic; Package Size: 0402; Supplier: DigiKey; Supplier Part Number: 118-CW100505-39NJCT-ND; RoHS: Compliant; Category: Fixed Inductors; Stock: 7266; Pricing: 1=0.25, 10=0.207, 100=0.1699, 1000=0.13972, 5000=0.12189 (USD); Case/Package: 0402; Case Code (Imperial): 0402; Case Code (Metric): 1005; China RoHS: Compliant; Composition: Ceramic, Wirewound; Country of Origin: Malaysia; Depth: 650µm; Export Control Classification Number (ECCN) Code: EAR99; Height: 500µm; Height - Seated (Max): 609.6µm; Harmonized Tariff Schedule (HTS) Code: 8504.50.80.00; Inductance Tolerance: 5%; Introduction Date: 2012-04-10; Length: 1mm; Lifecycle Status: Production; Max DC Current: 320mA; Max Operating Temperature: 125°C; Min Operating Temperature: -55°C; Mounting Technology: Surface Mount; Number of Terminals: 2; Packaging: Cut Tape; Radiation Hardening: No; REACH SVHC: Yes; Schedule B: 8504500000, 8504500000|8504500000|8504500000|8504500000|8504500000; Termination: SMD/SMT; Test Frequency: 250MHz; Width: 550µm; ComponentLink1URL: https://datasheet.octopart.com:443/CW100505-39NJ-Bourns-datasheet-179056621.pdf?src-supplier=Newark; ComponentLink1Description: https://datasheet.octopart.com:443/CW100505-39NJ-Bourns-datasheet-179056621.pdf?src-supplier=Newark; ComponentLink2URL: https://datasheet.octopart.com:443/CW100505-39NJ-Bourns-datasheet-20734168.pdf?src-supplier=RS+(Formerly+Allied+Electronics); ComponentLink2Description: https://datasheet.octopart.com:443/CW100505-39NJ-Bourns-datasheet-20734168.pdf?src-supplier=RS+(Formerly+Allied+Electronics); ComponentLink3URL: https://datasheet.octopart.com:443/CW100505-39NJ-Bourns-datasheet-12106525.pdf?src-supplier=RS+(Formerly+Allied+Electronics); ComponentLink3Description: https://datasheet.octopart.com:443/CW100505-39NJ-Bourns-datasheet-12106525.pdf?src-supplier=RS+(Formerly+Allied+Electronics); ComponentLink4URL: https://datasheet.octopart.com:443/CW100505-39NJ-Bourns-datasheet-44603171.pdf?src-supplier=JRH+Electronics; ComponentLink4Description: https://datasheet.octopart.com:443/CW100505-39NJ-Bourns-datasheet-44603171.pdf?src-supplier=JRH+Electronics; ComponentLink5URL: http://sigma.octopart.com:80/conflict_mineral_statement/Bourns-company-36.pdf?src-supplier=Compliance+Statements; ComponentLink5Description: http://sigma.octopart.com:80/conflict_mineral_statement/Bourns-company-36.pdf?src-supplier=Compliance+Statements
L7 = IND: Inductor RF Chip Multi-Layer 18nH 5% 100MHz 8Q-Factor Air 300mA 360mOhm DCR 0402 Paper T/R; Manufacturer: Murata Electronics; Manufacturer Part Number: LQG15HS18NJ02D; Manufacturer Lifecycle Status: IN PRODUCTION; Tolerance: +-5%; Current Rating: 400 mA; DC Resistance (DCR): 360mΩ; Max Current Rating: 400mA; Number of Circuits: 1; Q Factor: 8; Self Resonant Frequency: 2.2GHz; Shielding: Unshielded; Core Material: Air; Package Size: 0402; Supplier: DigiKey; Supplier Part Number: 490-2626-1-ND; RoHS: Compliant; Category: Fixed Inductors; Stock: 37671; Pricing: 1=0.1, 10=0.038, 100=0.031, 1000=0.02552, 5000=0.02225 (USD); Case/Package: 0402; Case Code (Imperial): 0402; Case Code (Metric): 1005; DC Current: 300mA; Depth: 550µm; Height: 500µm; Height - Seated (Max): 558.8µm; Value: 18nH; Inductance Tolerance: 5%; Lead Free: Lead Free; Length: 1mm; Lifecycle Status: Production; Max DC Current: 300mA; Max Operating Temperature: 125°C; Military Standard: Not; Min Operating Temperature: -55°C; Mounting Technology: Surface Mount; Number of Terminals: 2; Packaging: Cut Tape; Radiation Hardening: No; REACH SVHC: Yes; RMS Current (Irms): 400mA; Schedule B: 8504500000, 8504500000|8504500000, 8504500000|8504500000|8504500000, 8504500000|8504500000|8504500000|8504500000; ESR: 360mΩ; Termination: SMD/SMT; Test Frequency: 100MHz; Weight: 652.039032µg; Width: 500µm; ComponentLink1URL: https://datasheet.octopart.com:443/LQG15HS18NJ02D-Murata-datasheet-11550074.pdf?src-supplier=_legacy+Avnet; ComponentLink1Description: https://datasheet.octopart.com:443/LQG15HS18NJ02D-Murata-datasheet-11550074.pdf?src-supplier=_legacy+Avnet; ComponentLink2URL: https://datasheet.octopart.com:443/LQG15HS18NJ02D-Murata-datasheet-501917.pdf?src-supplier=_legacy+Avnet; ComponentLink2Description: https://datasheet.octopart.com:443/LQG15HS18NJ02D-Murata-datasheet-501917.pdf?src-supplier=_legacy+Avnet; ComponentLink3URL: https://datasheet.octopart.com:443/LQG15HS18NJ02D-Murata-datasheet-182938040.pdf?src-supplier=element14+APAC; ComponentLink3Description: https://datasheet.octopart.com:443/LQG15HS18NJ02D-Murata-datasheet-182938040.pdf?src-supplier=element14+APAC; ComponentLink4URL: https://datasheet.octopart.com:443/LQG15HS18NJ02D-Murata-datasheet-120161.pdf?src-supplier=Farnell; ComponentLink4Description: https://datasheet.octopart.com:443/LQG15HS18NJ02D-Murata-datasheet-120161.pdf?src-supplier=Farnell; ComponentLink5URL: https://datasheet.octopart.com:443/LQG15HS18NJ02D-Murata-datasheet-140712191.pdf?src-supplier=Ciiva; ComponentLink5Description: https://datasheet.octopart.com:443/LQG15HS18NJ02D-Murata-datasheet-140712191.pdf?src-supplier=Ciiva; ComponentLink6URL: https://datasheet.octopart.com:443/LQG15HS18NJ02D-Murata-datasheet-138753310.pdf?src-supplier=Ciiva; ComponentLink6Description: https://datasheet.octopart.com:443/LQG15HS18NJ02D-Murata-datasheet-138753310.pdf?src-supplier=Ciiva; ComponentLink7URL: https://datasheet.octopart.com:443/LQG15HS18NJ02D-Murata-datasheet-140710220.pdf?src-supplier=TME; ComponentLink7Description: https://datasheet.octopart.com:443/LQG15HS18NJ02D-Murata-datasheet-140710220.pdf?src-supplier=TME; ComponentLink8URL: https://datasheet.octopart.com:443/LQG15HS18NJ02D-Murata-datasheet-140568946.pdf?src-supplier=Arrow.cn; ComponentLink8Description: https://datasheet.octopart.com:443/LQG15HS18NJ02D-Murata-datasheet-140568946.pdf?src-supplier=Arrow.cn; ComponentLink9URL: https://datasheet.octopart.com:443/LQG15HS18NJ02D-Murata-datasheet-145449626.pdf?src-supplier=Geoflip; ComponentLink9Description: https://datasheet.octopart.com:443/LQG15HS18NJ02D-Murata-datasheet-145449626.pdf?src-supplier=Geoflip; ComponentLink10URL: https://datasheet.octopart.com:443/LQG15HS18NJ02D-Murata-datasheet-80324115.pdf?src-supplier=Future+Electronics; ComponentLink10Description: https://datasheet.octopart.com:443/LQG15HS18NJ02D-Murata-datasheet-80324115.pdf?src-supplier=Future+Electronics; ComponentLink11URL: https://datasheet.octopart.com:443/LQG15HS18NJ02D-Murata-datasheet-44660228.pdf?src-supplier=Future+Electronics; ComponentLink11Description: https://datasheet.octopart.com:443/LQG15HS18NJ02D-Murata-datasheet-44660228.pdf?src-supplier=Future+Electronics; ComponentLink12URL: https://datasheet.octopart.com/LQG15HS18NJ02D-Murata-datasheet-14391209.pdf; ComponentLink12Description: https://datasheet.octopart.com/LQG15HS18NJ02D-Murata-datasheet-14391209.pdf; ComponentLink13URL: http://sigma.octopart.com:80/reach_statement/Murata-company-16.pdf?src-supplier=Compliance+Statements; ComponentLink13Description: http://sigma.octopart.com:80/reach_statement/Murata-company-16.pdf?src-supplier=Compliance+Statements
U13 = HMC540SLP3E: RF ATTENUATOR 15DB 16VFQFN RF Attenuators 15dB 100 MHz ~ 8 GHz 16-VFQFN Exposed Pad; Manufacturer_Name: Analog Devices Inc; Manufacturer: Analog Devices; Manufacturer Lifecycle Status: PRODUCTION; Bandwidth: 7.9GHz; Frequency: 8GHz; Insertion Loss (dB): 1.7dB; Max Supply Voltage: 5V; Min Supply Voltage: 3.3V; Number of Bits: 4; Copyright: Copyright (C) 2026 Ultra Librarian. All rights reserved.; Manufacturer_Part_Number: HMC540SLP3E; Datasheet: https://www.analog.com/media/en/technical-documentation/data-sheets/hmc540s.pdf; RefDes: RefDes; Type: Type; Supplier: DigiKey; Supplier Part Number: 1127-3203-ND; Manufacturer Part Number: HMC540SLP3E; RoHS: Compliant; Category: RF Attenuators; Stock: 1982; Pricing: 1=9.32, 10=8.085, 25=7.6572, 100=7.0697, 250=6.71784, 500=6.4695, 1000=6.23558 (USD); Attenuation Value: 15dB; Case/Package: SMD/SMT; Height: 900µm; Lead Free: Contains Lead; Lifecycle Status: Production; Clock Frequency: 8GHz; Max Operating Temperature: 105°C; Min Operating Temperature: -40°C; Pins: 16; REACH SVHC: No; ComponentLink1URL: https://octopart.com:443/opatz8j6/c1?t=61YAlzvpPvZQiEn_B4tLAeLdW8O9epQwlf6qmnICSp7ZvazCJhB_z0omiItrYRio0t2XmYSexpg1AJRI-05gEtWLudIkctz1M8TwjP0sK9ZqirkGTfKMLw4ShO7iLCJ3GiJHrYB_ocIacKARDoXlqgfC2HIwHp-GsIx3YVmT9HdJpLsFvPXP-2ap3PEdAoFs_gp8jNMg8bmlu_b4ZcIzPTjyfMB2X9kWRkJYzNXBNzzKg1ou307TMijZyDU_fX2SPYsx3SdsfuKq3vDVw_gSvrYjR68cNKcvIZe8HXOgySNKuTagERiiBg&src-supplier=Analog+Devices; ComponentLink1Description: https://octopart.com:443/opatz8j6/c1?t=61YAlzvpPvZQiEn_B4tLAeLdW8O9epQwlf6qmnICSp7ZvazCJhB_z0omiItrYRio0t2XmYSexpg1AJRI-05gEtWLudIkctz1M8TwjP0sK9ZqirkGTfKMLw4ShO7iLCJ3GiJHrYB_ocIacKARDoXlqgfC2HIwHp-GsIx3YVmT9HdJpLsFvPXP-2ap3PEdAoFs_gp8jNMg8bmlu_b4ZcIzPTjyfMB2X9kWRkJYzNXBNzzKg1ou307TMijZyDU_fX2SPYsx3SdsfuKq3vDVw_gSvrYjR68cNKcvIZe8HXOgySNKuTagERiiBg&src-supplier=Analog+Devices; ComponentLink2URL: https://datasheet.octopart.com:443/HMC540SLP3E-Analog-Devices-datasheet-46764642.pdf?src-supplier=Analog+Devices; ComponentLink2Description: https://datasheet.octopart.com:443/HMC540SLP3E-Analog-Devices-datasheet-46764642.pdf?src-supplier=Analog+Devices; ComponentLink3URL: https://datasheet.octopart.com:443/HMC540SLP3E-Analog-Devices-datasheet-78863282.pdf?src-supplier=Farnell; ComponentLink3Description: https://datasheet.octopart.com:443/HMC540SLP3E-Analog-Devices-datasheet-78863282.pdf?src-supplier=Farnell; ComponentLink4URL: https://datasheet.octopart.com:443/HMC540SLP3E-Analog-Devices-datasheet-49785351.pdf?src-supplier=Farnell; ComponentLink4Description: https://datasheet.octopart.com:443/HMC540SLP3E-Analog-Devices-datasheet-49785351.pdf?src-supplier=Farnell; ComponentLink5URL: https://datasheet.octopart.com:443/HMC540SLP3E-Analog-Devices-datasheet-101563376.pdf?src-supplier=Farnell; ComponentLink5Description: https://datasheet.octopart.com:443/HMC540SLP3E-Analog-Devices-datasheet-101563376.pdf?src-supplier=Farnell; ComponentLink6URL: https://sigma.octopart.com:443/138799923/technical_drawing/Analog-Devices-HMC540SLP3E.pdf?src-supplier=Upverter; ComponentLink6Description: https://sigma.octopart.com:443/138799923/technical_drawing/Analog-Devices-HMC540SLP3E.pdf?src-supplier=Upverter; ComponentLink7URL: https://datasheet.octopart.com:443/HMC540SLP3E-Analog-Devices-datasheet-62144355.pdf?src-supplier=Newark; ComponentLink7Description: https://datasheet.octopart.com:443/HMC540SLP3E-Analog-Devices-datasheet-62144355.pdf?src-supplier=Newark; ComponentLink8URL: https://datasheet.octopart.com:443/HMC540SLP3E-Analog-Devices-datasheet-68517282.pdf?src-supplier=Newark; ComponentLink8Description: https://datasheet.octopart.com:443/HMC540SLP3E-Analog-Devices-datasheet-68517282.pdf?src-supplier=Newark; ComponentLink9URL: https://datasheet.octopart.com:443/HMC540SLP3E-Analog-Devices-datasheet-67642025.pdf?src-supplier=Newark; ComponentLink9Description: https://datasheet.octopart.com:443/HMC540SLP3E-Analog-Devices-datasheet-67642025.pdf?src-supplier=Newark; ComponentLink10URL: http://sigma.octopart.com:80/conflict_mineral_statement/Analog-Devices-company-33.pdf?src-supplier=Compliance+Statements; ComponentLink10Description: http://sigma.octopart.com:80/conflict_mineral_statement/Analog-Devices-company-33.pdf?src-supplier=Compliance+Statements; ComponentLink11URL: https://octopart.com:443/opatz8j6/c1?t=8MpW2mUQbP1CcI9gkcBFASzTY_CztGqP6E9qRqHcgzGvzB037_TD0k5VHFddzaQuMruDizLGs-rvt7A72KsYnh2eOmyST6FZ59w5XGOFyZGlhYISvGZ118uTmjuHhCEJdD_KEnZmCSAsYg2_1XO6n0sE2eRAkm5tmKD7GjMKXr7txPbDstcyHno_RtYXqfy87p9ZwslGBcmuu7YI5nUZmk7AnKXqR1EJ5iIzZWa_2Nf0c1wKRGqg3r1btKzde_332jY09EJNZcBEbHi3B5BR8vkfdBiU1xZf3QIFB1IBx0xhOvwKRkwJJg&src-supplier=Compliance+Statements; ComponentLink11Description: https://octopart.com:443/opatz8j6/c1?t=8MpW2mUQbP1CcI9gkcBFASzTY_CztGqP6E9qRqHcgzGvzB037_TD0k5VHFddzaQuMruDizLGs-rvt7A72KsYnh2eOmyST6FZ59w5XGOFyZGlhYISvGZ118uTmjuHhCEJdD_KEnZmCSAsYg2_1XO6n0sE2eRAkm5tmKD7GjMKXr7txPbDstcyHno_RtYXqfy87p9ZwslGBcmuu7YI5nUZmk7AnKXqR1EJ5iIzZWa_2Nf0c1wKRGqg3r1btKzde_332jY09EJNZcBEbHi3B5BR8vkfdBiU1xZf3QIFB1IBx0xhOvwKRkwJJg&src-supplier=Compliance+Statements